# Altium project 505.PRJPCB
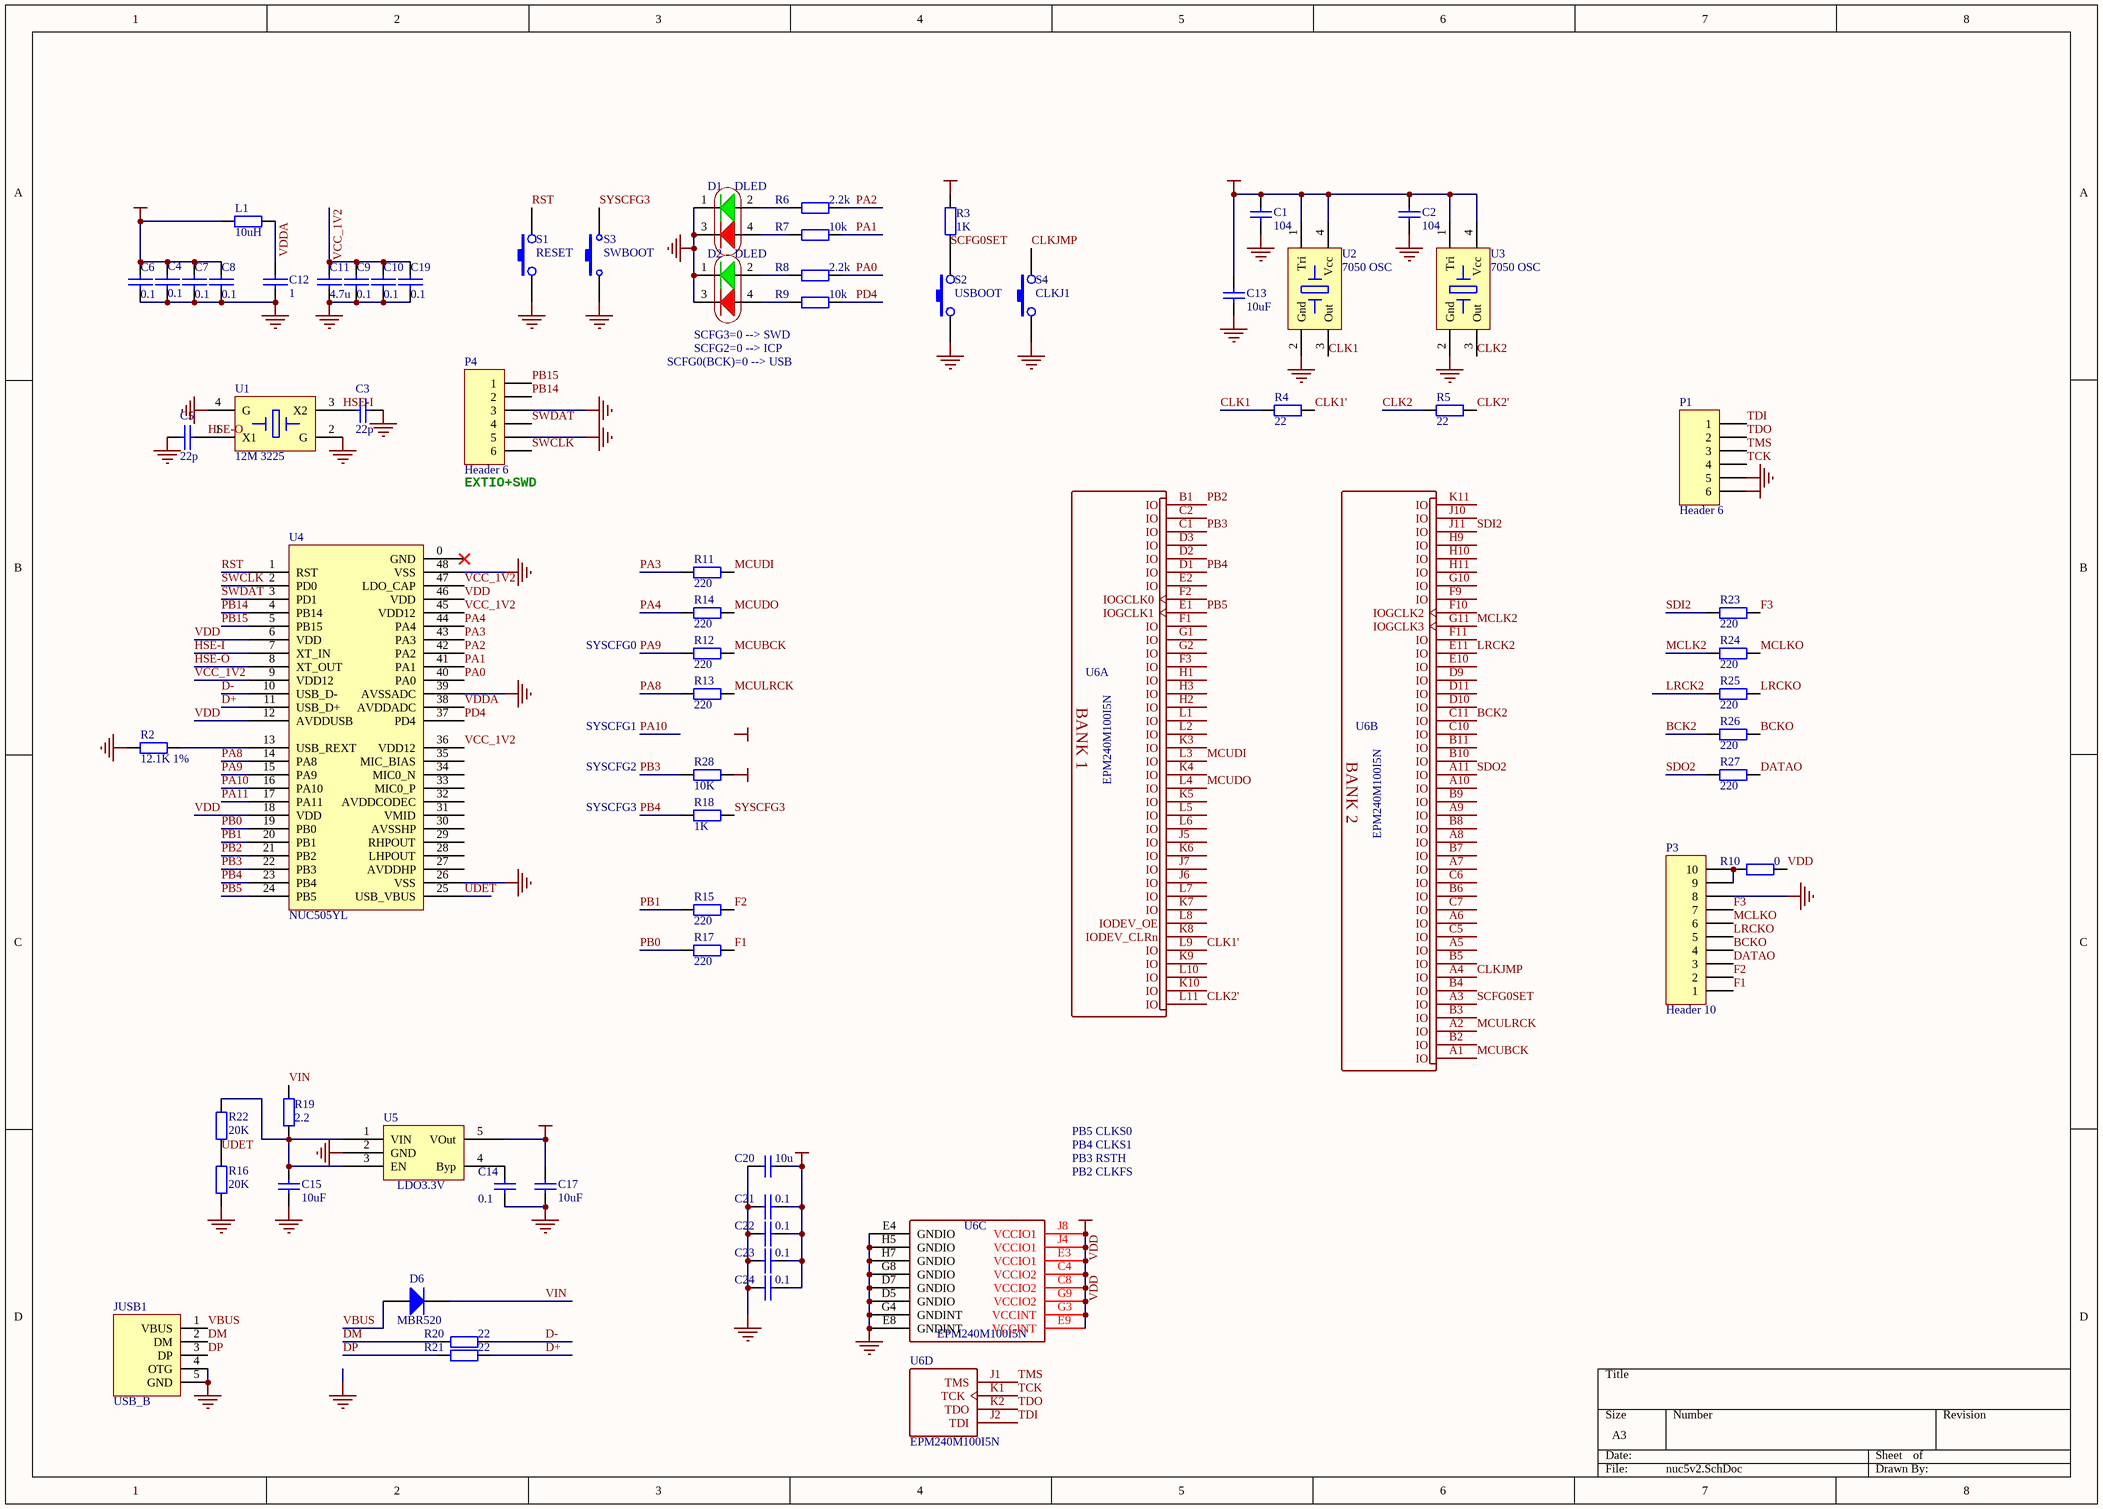
[diagram p0: nuc5v2.SchDoc]
1 sheet, 67 parts. Net scope: global (net labels, ports and power ports of the same name join across sheets).
Board file: nuc5v2.PcbDoc

## Sheet nuc5v2.SchDoc
size A3

### Parts
C1  104  [CC0603CAP]
C2  104  [CC0603CAP]
C3  22p  [0603]
C4  0.1  [0603]
C5  22p  [0603]
C6  0.1  [0603]
C7  0.1  [0603]
C8  0.1  [0603]
C9  0.1  [0603]
C10  0.1  [0603]
C11  4.7u  [0603]
C12  1  [0603]
C13  10uF  [CC0805CAP]
C14  0.1  [0603]
C15  10uF  [CC0805CAP]
C17  10uF  [CC0805CAP]
C19  0.1  [0603]
C20  10u  [CC0805CAP]
C21  0.1  [0603]
C22  0.1  [0603]
C23  0.1  [0603]
C24  0.1  [0603]
D1  DLED  [LED1204]
D2  DLED  [LED1204]
D6  MBR520  [SOD123]
JUSB1  USB_B  [USB-B-M]
L1  10uH  [CC0805RES]
P1  Header 6  [密脚针1.27mm*6]
P3  Header 10  [HDR1X10]
P4  Header 6  [密脚针1.27mm*6]
R2  12.1K 1%  [CR1005-0402]
R3  1K  [CR1005-0402]
R4  22  [CR1005-0402]
R5  22  [CR1005-0402]
R6  2.2k  [CR1005-0402]
R7  10k  [CR1005-0402]
R8  2.2k  [CR1005-0402]
R9  10k  [CR1005-0402]
R10  0  [0603]
R11  220  [CR1005-0402]
R12  220  [CR1005-0402]
R13  220  [CR1005-0402]
R14  220  [CR1005-0402]
R15  220  [CR1005-0402]
R16  20K  [CR1005-0402]
R17  220  [CR1005-0402]
R18  1K  [CR1005-0402]
R19  2.2  [CC0603RES]
R20  22  [CR1005-0402]
R21  22  [CR1005-0402]
R22  20K  [CR1005-0402]
R23  220  [CR1005-0402]
R24  220  [CR1005-0402]
R25  220  [CR1005-0402]
R26  220  [CR1005-0402]
R27  220  [CR1005-0402]
R28  10K  [CR1005-0402]
S1  RESET  [密脚针1.27mm*2]
S2  USBOOT  [密脚针1.27mm*2]
S3  SWBOOT  [密脚针1.27mm*2]
S4  CLKJ1  [密脚针1.27mm*2]
U1  12M 3225  [OSC-3225]
U2  7050 OSC  [OSC-3225]
U3  7050 OSC  [OSC-3225]
U4  NUC505YL  [LQFP-48]
U5  LDO3.3V  [SOT23-5]
U6  EPM240M100I5N  [MBGA100]  (parts A,B,C,D of 4)

### Nets
GND: C1.1 C2.2 C3.2 C4.2 C5.1 C6.2 C7.1 C8.2 C9.2 C10.2 C11.2 C12.2 C13.1 C14.2 C15.1 C17.1 C19.2 C20.2 C21.1 C22.1 C23.1 C24.1 D1.1 D1.3 D2.1 D2.3 JUSB1.4(OTG) JUSB1.5(GND) P1.5 P3.8 P4.3 P4.5 R2.2 R16.1 S1.1 S2.1 S3.1 S4.1 U1.2(G) U1.4(G) U2.2(Gnd) U3.2(Gnd) U4.26(VSS) U4.39(AVSSADC) U4.48(VSS) U5.2(GND) U6.D5(GNDIO) U6.D7(GNDIO) U6.E4(GNDIO) U6.E8(GNDINT) U6.G4(GNDINT) U6.G8(GNDIO) U6.H5(GNDIO) U6.H7(GNDIO)
VDD: C1.2 C2.1 C4.1 C6.1 C7.2 C8.1 C13.2 C17.2 C20.1 C21.2 C22.2 C23.2 C24.2 L1.1 P1.6 R3.2 R10.1 R28.2 U2.1(Tri) U2.4(Vcc) U3.1(Tri) U3.4(Vcc) U4.6(VDD) U4.12(AVDDUSB) U4.18(VDD) U4.46(VDD) U5.5(VOut) U6.C4(VCCIO2) U6.C8(VCCIO2) U6.E3(VCCIO1) U6.E9(VCCINT) U6.G3(VCCINT) U6.G9(VCCIO2) U6.J4(VCCIO1) U6.J8(VCCIO1)
BCK2: R26.1 U6.C11(IO)
BCKO: P3.4 R26.2
CLK1: R4.1 U2.3(Out)
CLK1': R4.2 U6.L9(IO)
CLK2: R5.1 U3.3(Out)
CLK2': R5.2 U6.L11(IO)
CLKJMP: S4.2 U6.A4(IO)
D+: R21.1 U4.11(USB_D+)
D-: R20.1 U4.10(USB_D-)
DATAO: P3.3 R27.2
DM: JUSB1.2(DM) R20.2
DP: JUSB1.3(DP) R21.2
F1: P3.1 R17.1
F2: P3.2 R15.1
F3: P3.7 R23.2
HSE-I: C3.1 U1.3(X2) U4.7(XT_IN)
HSE-O: C5.2 U1.1(X1) U4.8(XT_OUT)
LRCK2: R25.2 U6.E11(IO)
LRCKO: P3.5 R25.1
MCLK2: R24.2 U6.G11(IOGCLK3)
MCLKO: P3.6 R24.1
MCUBCK: R12.1 U6.A1(IO)
MCUDI: R11.2 U6.L3(IO)
MCUDO: R14.1 U6.L4(IO)
MCULRCK: R13.2 U6.A2(IO)
PA0: R8.1 U4.40(PA0)
PA1: R7.1 U4.41(PA1)
PA2: R6.1 U4.42(PA2)
PA3: R11.1 U4.43(PA3)
PA4: R14.2 U4.44(PA4)
PA8: R13.1 U4.14(PA8)
PA9: R12.2 U4.15(PA9)
PA10: U4.16(PA10)
PA11: U4.17(PA11)
PB0: R17.2 U4.19(PB0)
PB1: R15.2 U4.20(PB1)
PB2: U4.21(PB2) U6.B1(IO)
PB3: R28.1 U4.22(PB3) U6.C1(IO)
PB4: R18.1 U4.23(PB4) U6.D1(IO)
PB5: U4.24(PB5) U6.E1(IOGCLK1)
PB14: P4.2 U4.4(PB14)
PB15: P4.1 U4.5(PB15)
PD4: R9.1 U4.37(PD4)
RST: S1.2 U4.1(RST)
SCFG0SET: R3.1 S2.2 U6.A3(IO)
SDI2: R23.1 U6.J11(IO)
SDO2: R27.1 U6.A11(IO)
SWCLK: P4.6 U4.2(PD0)
SWDAT: P4.4 U4.3(PD1)
SYSCFG3: R18.2 S3.2
TCK: P1.4 U6.K1(TCK)
TDI: P1.1 U6.J2(TDI)
TDO: P1.2 U6.K2(TDO)
TMS: P1.3 U6.J1(TMS)
UDET: R16.2 R22.1 U4.25(USB_VBUS)
VBUS: D6.1(A) JUSB1.1(VBUS)
VCC_1V2: C9.1 C10.1 C11.1 C19.1 U4.9(VDD12) U4.36(VDD12) U4.45(VDD12) U4.47(LDO_CAP)
VDDA: C12.1 L1.2 U4.38(AVDDADC)
VIN: D6.2(K) R19.1
NetC14_1: C14.1 U5.4(Byp)
NetC15_2: C15.2 R19.2 R22.2 U5.1(VIN) U5.3(EN)
NetD1_2: D1.2 R6.2
NetD1_4: D1.4 R7.2
NetD2_2: D2.2 R8.2
NetD2_4: D2.4 R9.2
NetP3_9: P3.9 P3.10 R10.2
NetR2_1: R2.1 U4.13(USB_REXT)

Not connected (* = marked no-connect by the designer): U4 0(GND)* 27(AVDDHP) 28(LHPOUT) 29(RHPOUT) 30(AVSSHP) 31(VMID) 32(AVDDCODEC) 33(MIC0_P) 34(MIC0_N) 35(MIC_BIAS); U6 A5(IO) A6(IO) A7(IO) A8(IO) A9(IO) A10(IO) B2(IO) B3(IO) B4(IO) B5(IO) B6(IO) B7(IO) B8(IO) B9(IO) B10(IO) B11(IO) C2(IO) C5(IO) C6(IO) C7(IO) C10(IO) D2(IO) D3(IO) D9(IO) D10(IO) D11(IO) E2(IO) E10(IO) F1(IO) F2(IOGCLK0) F3(IO) F9(IO) F10(IOGCLK2) F11(IO) G1(IO) G2(IO) G10(IO) H1(IO) H2(IO) H3(IO) H9(IO) H10(IO) H11(IO) J5(IO) J6(IO) J7(IO) J10(IO) K3(IO) K4(IO) K5(IO) K6(IO) K7(IO) K8(IODEV_CLRn) K9(IO) K10(IO) K11(IO) L1(IO) L2(IO) L5(IO) L6(IO) L7(IO) L8(IODEV_OE) L10(IO)

### Notes on the sheet
- SCFG0(BCK)=0 --> USB
- SCFG3=0 --> SWD
- SCFG2=0 --> ICP
- (near P4) EXTIO+SWD
- SYSCFG0
- SYSCFG2
- SYSCFG1
- SYSCFG3
- PB5 CLKS0
- PB4 CLKS1
- PB3 RSTH
- PB2 CLKFS
- Labels drawn without touching a wire or pin: VDD
- (in symbol EPM240M100I5N, part A) BANK 1
- (in symbol EPM240M100I5N, part B) BANK 2

### Library data of the parts
C1 C2 = Cap6: Capacitor0603
C3-C12 C19 C21-C24 = CAP: Capacitor
C13-C15 C17 C20 = Cap8: Capacitor0805
D1 D2 = LED1204: 1204双色LED
D6 = Diode: Default Diode
JUSB1 = USB_B: USB Mini/Micro 5P
L1 = Res8: Resistor0805
P1 P4 = Header 6: Header, 6-Pin; LatestRevisionDate: 17-Jul-2002; LatestRevisionNote: Re-released for DXP Platform.; Publisher: Altium Limited
P3 = Header 10: Header, 10-Pin; LatestRevisionDate: 17-Jul-2002; LatestRevisionNote: Re-released for DXP Platform.; Publisher: Altium Limited
R2-R15 R17-R21 R23-R28 = Res6: Resistor0603
R16 R22 = R: 贴片电阻; BOM名称: 贴片电阻
S1 S2 S4 = SW-PB
S3 = SW-PB: Switch; LatestRevisionDate: 17-Jul-2002; LatestRevisionNote: Re-released for DXP Platform.; Publisher: Altium Limited; Published: 24-Mar-1999
U1 = XTAL
U2 U3 = XTAL_OSC
U5 = LP2985-5: LP2985 5V LDO
U6 = EPM240M100I5N: subpart_no: 1; description: MAX II 3.32.5V CPLD, 80 IOs, 240 Logic Elements, 100-Pin Micro Fineline BGA, Industrial Temperature, Speed Grade 5, Pb-Free; spicePre: U; spiceSymbolName: EPM240M100I5N COPY